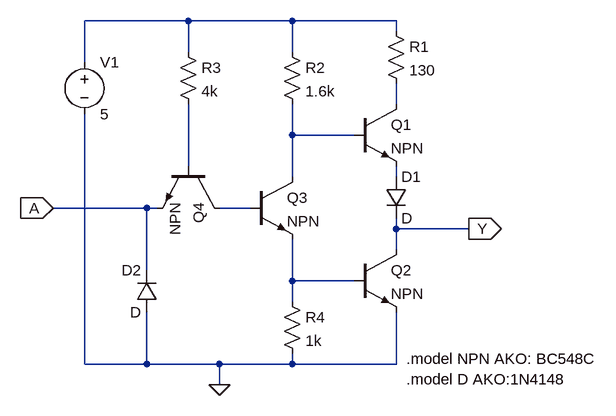
[diagram p0: schematic NOT.asc]
NOT.asc, the LTspice schematic file:
Version 4
SHEET 1 880 680
WIRE -32 -64 -192 -64
WIRE 128 -64 -32 -64
WIRE 288 -64 128 -64
WIRE 288 -48 288 -64
WIRE -32 -16 -32 -64
WIRE 128 -16 128 -64
WIRE -192 0 -192 -64
WIRE 288 64 288 32
WIRE 128 112 128 64
WIRE 224 112 128 112
WIRE -32 160 -32 64
WIRE 128 176 128 112
WIRE 288 176 288 160
WIRE -96 224 -240 224
WIRE -80 224 -96 224
WIRE 64 224 16 224
WIRE 288 256 288 240
WIRE 400 256 288 256
WIRE 288 288 288 256
WIRE -96 320 -96 224
WIRE 128 336 128 272
WIRE 224 336 128 336
WIRE 128 368 128 336
WIRE -192 464 -192 80
WIRE -96 464 -96 384
WIRE -96 464 -192 464
WIRE 16 464 -96 464
WIRE 128 464 128 448
WIRE 128 464 16 464
WIRE 288 464 288 384
WIRE 288 464 128 464
WIRE 16 496 16 464
FLAG 16 496 0
FLAG 400 256 Y
IOPIN 400 256 Out
FLAG -240 224 A
IOPIN -240 224 In
SYMBOL npn 224 64 R0
SYMATTR InstName Q1
SYMBOL npn 224 288 R0
SYMATTR InstName Q2
SYMBOL npn 64 176 R0
SYMATTR InstName Q3
SYMBOL npn 16 160 R90
SYMATTR InstName Q4
SYMBOL res 272 -64 R0
SYMATTR InstName R1
SYMATTR Value 130
SYMBOL res 112 -32 R0
SYMATTR InstName R2
SYMATTR Value 1.6k
SYMBOL res -48 -32 R0
SYMATTR InstName R3
SYMATTR Value 4k
SYMBOL res 112 352 R0
SYMATTR InstName R4
SYMATTR Value 1k
SYMBOL diode 272 176 R0
SYMATTR InstName D1
SYMBOL diode -80 384 R180
WINDOW 0 24 64 Left 2
WINDOW 3 24 0 Left 2
SYMATTR InstName D2
SYMBOL voltage -192 -16 R0
WINDOW 123 0 0 Left 2
WINDOW 39 0 0 Left 2
SYMATTR InstName V1
SYMATTR Value 5
TEXT 304 456 Left 2 !.model NPN AKO: BC548C\n.model D AKO:1N4148

The netlist it stands for:
* NOT.asc
Q1 N002 N003 N005 0 NPN
Q2 Y N007 0 0 NPN
Q3 N003 N006 N007 0 NPN
Q4 N006 N004 A 0 NPN
R1 N001 N002 130
R2 N001 N003 1.6k
R3 N001 N004 4k
R4 N007 0 1k
D1 N005 Y D
D2 0 A D
V1 N001 0 5
.model D D
.lib standard.dio
.model NPN NPN
.model PNP PNP
.lib standard.bjt
.model NPN AKO: BC548C
.model D AKO:1N4148
.backanno
.end